# Altium project EEG_RibbonCable.PrjPcb
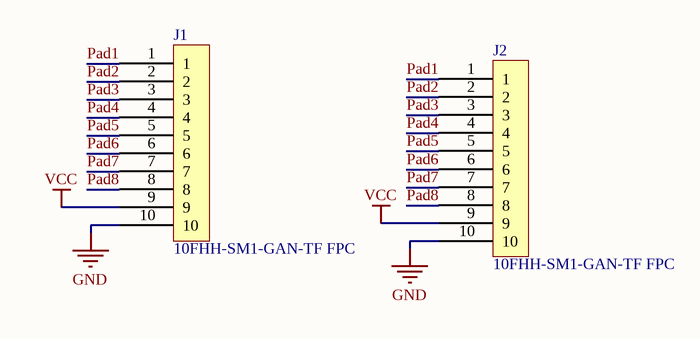
[diagram p0: Sheet1.SchDoc]
1 sheet, 2 parts. Net scope: global (net labels, ports and power ports of the same name join across sheets).
Board file: PCB1.PcbDoc

## Sheet Sheet1.SchDoc
size 119 x 100 mm; SheetNumber: 1; SheetTotal: 1

### Parts
J1  10FHH-SM1-GAN-TF FPC  [PCBComponent_1]
J2  10FHH-SM1-GAN-TF FPC  [PCBComponent_1]

### Nets
GND: J1.10 J2.10
VCC: J1.9 J2.9
Pad1: J1.1 J2.1
Pad2: J1.2 J2.2
Pad3: J1.3 J2.3
Pad4: J1.4 J2.4
Pad5: J1.5 J2.5
Pad6: J1.6 J2.6
Pad7: J1.7 J2.7
Pad8: J1.8 J2.8